# Altium schematic sheet AtlasMCU_STM32.SchDoc: STM32 Based MCU
size A3 portrait; DrawnBy: Manpreet Singh; Engineer: Manpreet Singh; Revision: 0.1; SheetNumber: 2; SheetTotal: 3
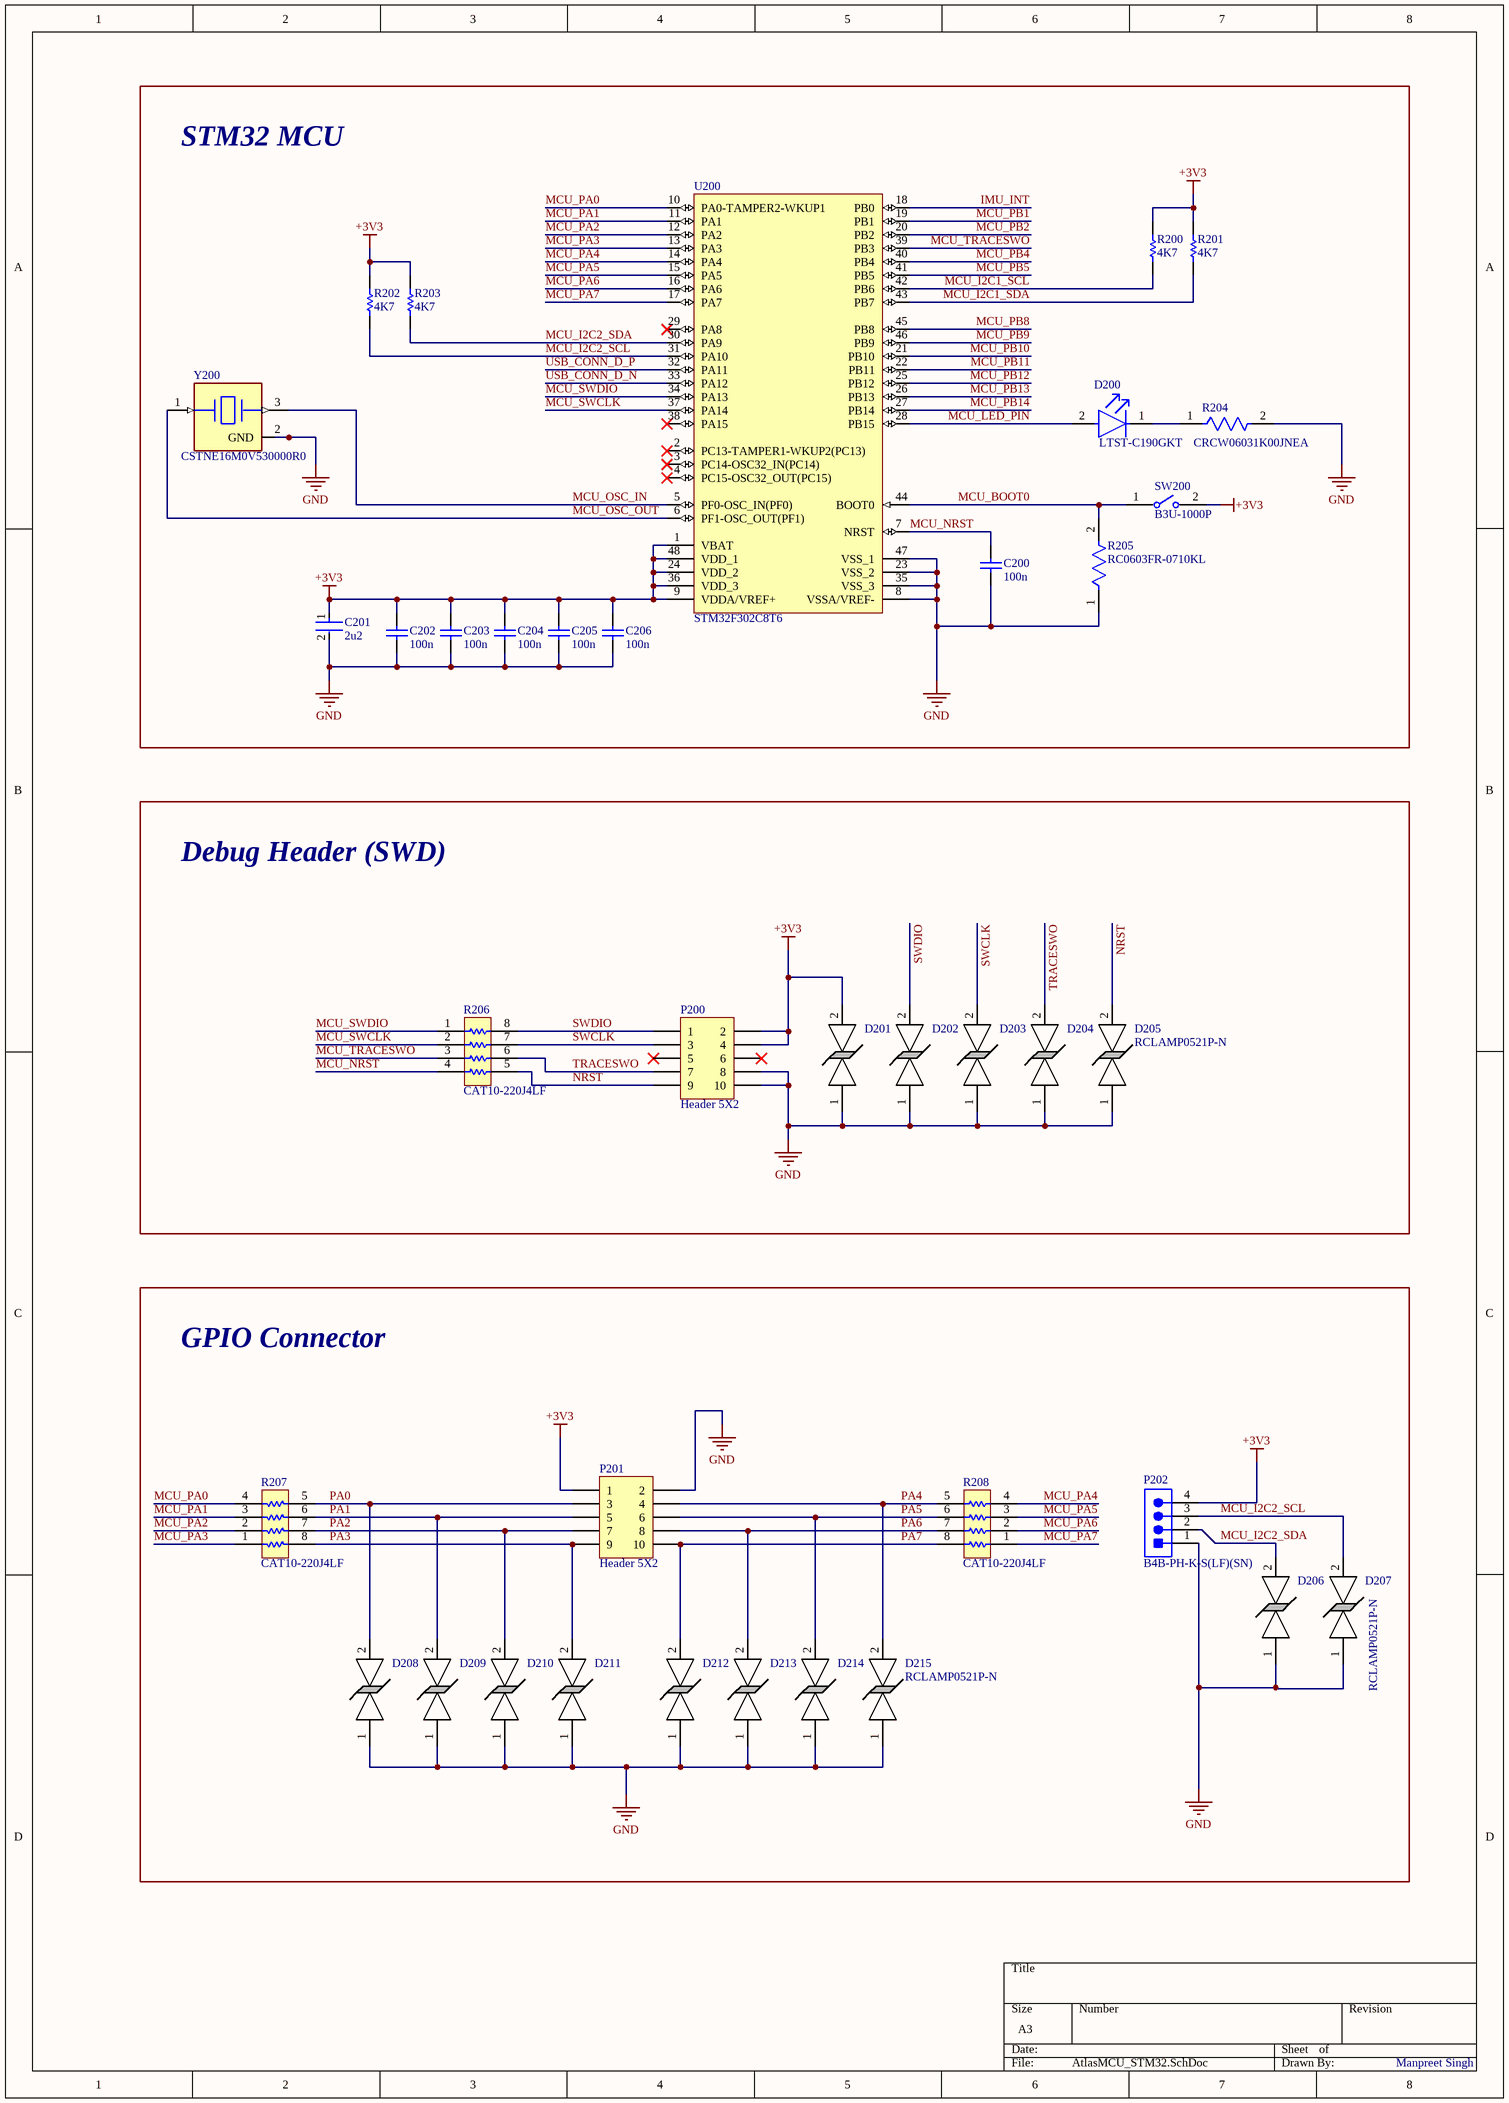
[diagram p0: AtlasMCU_STM32.SchDoc]

## Parts
C200  100n  [CAPC1608X90X35ML10T15]
C201  2u2  [FP-GRM188-0_1-e0_2_0_5-MFG]
C202  100n  [CAPC1608X90X35ML10T15]
C203  100n  [CAPC1608X90X35ML10T15]
C204  100n  [CAPC1608X90X35ML10T15]
C205  100n  [CAPC1608X90X35ML10T15]
C206  100n  [CAPC1608X90X35ML10T15]
D200  LTST-C190GKT  [FP-LTST-C190GKT-MFG]
D201  RCLAMP0521P-N  [RCLAMP0521P-N]  (value not drawn)
D202  RCLAMP0521P-N  [RCLAMP0521P-N]  (value not drawn)
D203  RCLAMP0521P-N  [RCLAMP0521P-N]  (value not drawn)
D204  RCLAMP0521P-N  [RCLAMP0521P-N]  (value not drawn)
D205  RCLAMP0521P-N  [RCLAMP0521P-N]
D206  RCLAMP0521P-N  [RCLAMP0521P-N]  (value not drawn)
D207  RCLAMP0521P-N  [RCLAMP0521P-N]
D208  RCLAMP0521P-N  [RCLAMP0521P-N]  (value not drawn)
D209  RCLAMP0521P-N  [RCLAMP0521P-N]  (value not drawn)
D210  RCLAMP0521P-N  [RCLAMP0521P-N]  (value not drawn)
D211  RCLAMP0521P-N  [RCLAMP0521P-N]  (value not drawn)
D212  RCLAMP0521P-N  [RCLAMP0521P-N]  (value not drawn)
D213  RCLAMP0521P-N  [RCLAMP0521P-N]  (value not drawn)
D214  RCLAMP0521P-N  [RCLAMP0521P-N]  (value not drawn)
D215  RCLAMP0521P-N  [RCLAMP0521P-N]
P200  Header 5X2  [HDR2X5]
P201  Header 5X2  [HDR2X5]
P202  B4B-PH-K-S(LF)(SN)  [JST-B4B-PH-K-S_V]
R200  4K7  [RESC1609X50X30NL10T20]
R201  4K7  [RESC1609X50X30NL10T20]
R202  4K7  [RESC1609X50X30NL10T20]
R203  4K7  [RESC1609X50X30NL10T20]
R204  CRCW06031K00JNEA  [FP-CRCW0603-e3-IPC_C]
R205  RC0603FR-0710KL  [FP-RC0603-0_55-IPC_C]
R206  CAT10-220J4LF  [BOUR-CAT10_V]
R207  CAT10-220J4LF  [BOUR-CAT10_V]
R208  CAT10-220J4LF  [BOUR-CAT10_V]
SW200  B3U-1000P  [FP-B3U-1000P-MFG]
U200  STM32F302C8T6  [STM-LQFP48_M]
Y200  CSTNE16M0V530000R0  [FP-CSTNE16M0V530000R0-MFG]

## Blocks framed on the sheet
STM32 MCU: C200-C206 D200 R200-R205 SW200 U200 Y200
Debug Header (SWD): D201-D205 P200 R206
GPIO Connector: D206-D215 P201 P202 R207 R208

## Nets
+3V3: C201.1 C202.2 C203.2 C204.2 C205.2 C206.2 D201.2 P200.2 P200.4 P201.1 P202.4 R200.2 R201.2 R202.2 R203.2 SW200.2 U200.1(VBAT) U200.9(VDDA/VREF+) U200.24(VDD_2) U200.36(VDD_3) U200.48(VDD_1)
GND: C200.1 C201.2 C202.1 C203.1 C204.1 C205.1 C206.1 D201.1 D202.1 D203.1 D204.1 D205.1 D206.1 D207.1 D208.1 D209.1 D210.1 D211.1 D212.1 D213.1 D214.1 D215.1 P200.8 P200.10 P201.2 P202.1 R204.2 R205.1 U200.8(VSSA/VREF-) U200.23(VSS_2) U200.35(VSS_3) U200.47(VSS_1) Y200.2(GND)
IMU_INT: U200.18(PB0)
MCU_BOOT0: R205.2 SW200.1 U200.44(BOOT0)
MCU_I2C1_SCL: R200.1 U200.42(PB6)
MCU_I2C1_SDA: R201.1 U200.43(PB7)
MCU_I2C2_SCL: D207.2 P202.3 R202.1 U200.31(PA10)
MCU_I2C2_SDA: D206.2 P202.2 R203.1 U200.30(PA9)
MCU_LED_PIN: D200.2(A) U200.28(PB15)
MCU_NRST: C200.2 R206.4 U200.7(NRST)
MCU_OSC_IN: U200.5(PF0-OSC_IN(PF0)) Y200.3(Output)
MCU_OSC_OUT: U200.6(PF1-OSC_OUT(PF1)) Y200.1(Input)
MCU_PA0: R207.4 U200.10(PA0-TAMPER2-WKUP1)
MCU_PA1: R207.3 U200.11(PA1)
MCU_PA2: R207.2 U200.12(PA2)
MCU_PA3: R207.1 U200.13(PA3)
MCU_PA4: R208.4 U200.14(PA4)
MCU_PA5: R208.3 U200.15(PA5)
MCU_PA6: R208.2 U200.16(PA6)
MCU_PA7: R208.1 U200.17(PA7)
MCU_PB1: U200.19(PB1)
MCU_PB2: U200.20(PB2)
MCU_PB4: U200.40(PB4)
MCU_PB5: U200.41(PB5)
MCU_PB8: U200.45(PB8)
MCU_PB9: U200.46(PB9)
MCU_PB10: U200.21(PB10)
MCU_PB11: U200.22(PB11)
MCU_PB12: U200.25(PB12)
MCU_PB13: U200.26(PB13)
MCU_PB14: U200.27(PB14)
MCU_SWCLK: R206.2 U200.37(PA14)
MCU_SWDIO: R206.1 U200.34(PA13)
MCU_TRACESWO: R206.3 U200.39(PB3)
NRST: D205.2 P200.9 R206.5
PA0: D208.2 P201.3 R207.5
PA1: D209.2 P201.5 R207.6
PA2: D210.2 P201.7 R207.7
PA3: D211.2 P201.9 R207.8
PA4: D215.2 P201.4 R208.5
PA5: D214.2 P201.6 R208.6
PA6: D213.2 P201.8 R208.7
PA7: D212.2 P201.10 R208.8
SWCLK: D203.2 P200.3 R206.7
SWDIO: D202.2 P200.1 R206.8
TRACESWO: D204.2 P200.7 R206.6
USB_CONN_D_N: U200.33(PA12)
USB_CONN_D_P: U200.32(PA11)
NetD200_1: D200.1(C) R204.1

Not connected (* = marked no-connect by the designer): P200 5* 6*; U200 2(PC13-TAMPER1-WKUP2(PC13))* 3(PC14-OSC32_IN(PC14))* 4(PC15-OSC32_OUT(PC15))* 29(PA8)* 38(PA15)*

## Library data of the parts
C200 C202-C206 = CMP-2100-03643-1: Chip Capacitor, 0.1 uF, +/- 10%, 50 V, -55 to 125 degC, 0603 (1608 Metric), RoHS, Tape and Reel; Manufacturer: Murata; Dielectric Material: Ceramic; Voltage Rating: 50V; Capacitance: 100nF; Dielectric: X7R; Insulation Resistance: 10GR; Case Code (Metric): 1608; Lead Free: LeadFree; Depth: 0.8mm; Number of Pins: 2; Radiation Hardening: No; Case/Package: 0603; Manufacturer URL: http://www.murata.com/; Packaging: TapeandReel; Length: 1.6mm; Contact Plating: Tin; Datasheet URL: http://psearch.en.murata.com/capacitor/product/GRM188R71H104KA93%23.pdf; Tolerance: 10%; Case Code (Imperial): 0603; Min Operating Temperature: -55degC; RoHSCompliant: true; Voltage: 50V; Termination: SMD/SMT; Mount: SurfaceMount; Material: Ceramic; Package Quantity: 1; Height: 0.8mm; Thickness: 0.035inch; REACH SVHC: NoSVHC; Max Operating Temperature: 125degC; Width: 0.8mm; Package Reference: 0603; Voltage Rating (DC): 50V; Datasheet Version: 42675.0; Package Description: 2-Pin Surface Mount Device, Body 1.6 x 0.8 mm
C201 = CMP-2006-02836-2: Chip Multilayer Ceramic Capacitors for General Purpose, 0603, 2.2uF, X7R, 15%, 10%, 10V; Case Code (Metric): 1608; Height: 0.8mm; Packaging: Cut Tape; Voltage: 10V; Lead Free: Lead Free; Min Operating Temperature: -55°C; Voltage Rating (DC): 10V; Max Operating Temperature: 125°C; Voltage Rating: 10V; Dielectric: X7R; Depth: 0.8mm; Case Code (Imperial): 0603; Termination: SMD/SMT; Case/Package: 0603; Number of Pins: 2; REACH SVHC: No SVHC; Mount: Surface Mount; Width: 0.031inch; Material: Ceramic; Capacitance: 2.2uF; Package Quantity: 1; Weight: 7.1E-05oz; Length: 1.6mm; Thickness: 0.035inch; Tolerance: 10%
D200 = CMP-22017-000005-2: LED GREEN CLEAR CHIP SMD; Dominant Wavelength: 569nm; Reverse Voltage: 5V; Lens Color: Colorless; Viewing Angle: 130°; Voltage: 2V; Forward Current: 30mA; Power Dissipation: 100mW; Luminous Intensity: 6mcd; Number of LEDs: 1; Forward Voltage: 2.1V; Wavelength: 565nm; Test Current: 10mA; Min Operating Temperature: -55°C; Lens Style: Clear; Mount: Surface Mount; Width: 0.8mm; Packaging: Tape and Reel; Lens Transparency: Clear; Case Code (Metric): 1608; Depth: 0.8mm; Case Code (Imperial): 0603; Case/Package: 0603; Number of Pins: 2; Max Operating Temperature: 85°C; Lead Free: Lead Free; Number of Elements: 1; Length: 1.6mm; Height: 0.8mm; Package Quantity: 1; Power Rating: 100mW; Radiation Hardening: No; Illumination Color: Green; Color: Green
P200 P201 = Header 5X2: Header, 5-Pin, Dual row; LatestRevisionDate: 17-Jul-2002; LatestRevisionNote: Re-released for DXP Platform.; Publisher: Altium Limited
P202 = CMP-2000-05165-1: Male Header, Pitch 2 mm, 1 x 4 Position, Height 6 mm, Tail Length 3.4 mm, -25 to 85 degC, RoHS, Bulk; Manufacturer: JST; No of Positions: 4; Style/Orientation: StraightHeader/Plug; Pitch: 2mm; Datasheet URL: http://datasheet.octopart.com/B4B-PH-K-S%28LF%29%28SN%29-JST-datasheet-10558886.pdf; Type: ShroudedHeader; Manufacturer URL: http://www.jst.com/home2.html; Termination: Crimp; Datasheet Version: Apr-09
R200-R203 = CMP-2000-03167-1: CRCW06032K20FKEA; Manufacturer: Vishay Dale; Part Number: CRCW06032K20FKEA
R204 = CMP-02407-007100-1: RES Thick Film, 1kΩ, 5%, 0.1W, 200ppm/°C, 0603; Power Rating: 100mW; Voltage Rating: 75V; Resistance: 1kR; Height: 0.02inch; Number of Terminations: 2; Radiation Hardening: No; Max Operating Temperature: 155°C; Packaging: Tape and Reel; Package Quantity: 1; Military Standard: Not; Case/Package: 0603; Weight: 7.1E-05oz; Tolerance: 5%; Temperature Coefficient: 200ppm/°C; Termination: SMD/SMT; Case Code (Metric): 1608; Length: 1.55mm; Min Operating Temperature: -55°C; Depth: 0.85mm; Composition: Thick Film; Width: 0.033inch; Number of Pins: 2; Contact Plating: Tin; Max Power Dissipation: 100mW; Voltage Rating (DC): 75V; Case Code (Imperial): 0603; Lead Free: Lead Free; Features: Automotive AEC-Q200
R205 = CMP-2100-03664-2: RES 10K OHM 1% 1/10W 0603; Voltage Rating: 75V; Voltage Rating (DC): 50V; Resistance: 10kR; Power Rating: 100mW; Temperature Coefficient: 100ppm/°C; Depth: 0.8mm; Termination: SMD/SMT; Resistor Type: Thick Film; Series: RC; Construction: Rectangular; Features: Moisture Resistant; Packaging: Tape and Reel; Min Operating Temperature: -55°C; Number of Terminations: 2; Lead Pitch: 0.3mm; RoHS Compliant: Yes; Case/Package: 0603; Resistance Tolerance: 1%; Military Standard: Not; Weight: 7.1E-05oz; Number of Pins: 2; Tolerance: 1%; Length: 1.6mm; Case Code (Imperial): 0603; Lead Free: Lead Free; Width: 0.8mm; Max Power Dissipation: 100mW; Height: 0.45mm; Max Operating Temperature: 155°C; Case Code (Metric): 1608; Size Code: 0603
R206-R208 = CMP-2000-06066-1: Chip Resistor Array, 22 Ohm, +/- 5%, -55 to 125 degC, 8-Pin SMD, RoHS, Tape and Reel; Manufacturer: Bourns; Resistance: 22Ohms; Temperature, Operating: -55to+125°C; Power, Rating: 0.125W; Number of Resistors: 4; Temperature, Coefficent: ±250; Brand/Series: CAT10Series; Circuit: IsolatedArray; Mounting Type: SurfaceMount; Tolerance: ±5%; Datasheet Version: 01/2015; Package Description: 8-Pin Surface Mount Device, Body 2 x 1 mm, Pitch 0.5 mm; Number of Terminals: 8; Dimensions: 0.44x0.039x0.022(2x1x0.55)LxWxHin.(mm); Package Reference: CAT10; Mounting Technology: SurfaceMount; Manufacturer URL: http://www.bourns.com/; Package Type: SMT; Datasheet URL: http://www.bourns.com/docs/Product-Datasheets/CAT10.pdf
SW200 = CMP-2100-03586-2: SWITCH TACTILE SPST-NO 0.05A 12V; Contact Resistance: 100mR; Operating Force: 1.5N; Max Current Rating: 50mA; Switch Travel: 0.15mm; Actuator Type: Standard; Mechanical Life: 200000Cycles; Ratings: Dust Proof; Illumination Type: Non-Illuminated; Throw Configuration: SPST; Actuator Length: 0.4mm; Switch Function: Off-Mom; Height: 1.2mm; Width: 3mm; Weight: 0.000776oz; Contact Material: Silver; Max Voltage Rating (DC): 12V; Insulation Resistance: 100MR; Lead Free: Lead Free; Current Rating: 50mA; Termination: SMD/SMT; Length: 4mm; Voltage Rating (DC): 12V; Contact Current Rating: 50mA; Orientation: Straight; Depth: 2.5mm; Max Operating Temperature: 70°C; Packaging: Tape and Reel; Min Operating Temperature: -25°C; Package Quantity: 1; Mount: Surface Mount; Electrical Life: 200000Cycles
U200 = CMP-0537-00011-1: ARM Cortex-M4 32-bit MCU, 64 KB Flash, 16 KB Internal RAM, 37 I/Os, 48-Pin LQFP, -40 to 85 degC, Tray; Operating Frequency(F) (Processor speed) (MHz): 72; Internal RAM Size (kB): 16; D/A Converter: 1; FLASH Size (Prog) (kB): 64; I/Os (High Current): 37; Supply Voltage(Vcc) min (V): 2; ComponentLink2Description: Datasheet; Package Reference: LQFP48; Package Description: 48-Pin Low Profile Quad Flat Package, Body 7 x 7 mm, Pitch 0.5 mm; Packing: Tray; ComponentLink1URL: http://www.st.com/; ComponentLink1Description: Manufacturer URL; DatasheetVersion: Rev. 5; Core: ARM Cortex-M4; Mounting Technology: Surface Mount; ComponentLink2URL: http://www.st.com/st-web-ui/static/active/en/resource/technical/document/datasheet/DM00093333.pdf
Y200 = CMP-06054-000001-1: CERAMIC RES 16.0000MHZ 15PF SMD; Manufacturer: Murata; Tolerance: 0.5%; Stability: 0.3%; Frequency: 16MHz; Esr: 40Ω; Lead Free: Yes; ComponentLink2URL: https://www.murata.com/en-sg/products/productdata/8801162231838/SPEC-CSTNE16M0V530000R0.pdf?1545967809000; ComponentLink2Description: Datasheet; Device Class L3: Crystals; Load Capacitance: 15pF; Temperature: -40°C to +85°C; Temperature Range High: +85°C; Series: CSTNE_V; Mouser Description: Ceramic Resonator 16MHz ±0.5% (Tol) ±0.3% (Stability) 15pF 40Ohm 3-Pin CSMD T/R; Automotive: No; RoHS: TRUE; Device Class L2: Crystals / Oscillators; Manufacturer Part Number: CSTNE16M0V530000R0; Package: 0; Category: Crys; Device Class L1: Passive Components; Height: 1mm; Temperature Range Low: -40°C; Digikey Description: CERAMIC RES 16.0000MHZ 15PF SMD; Octopart: https://octopart.com/cstne16m0v530000r0-murata-91406924